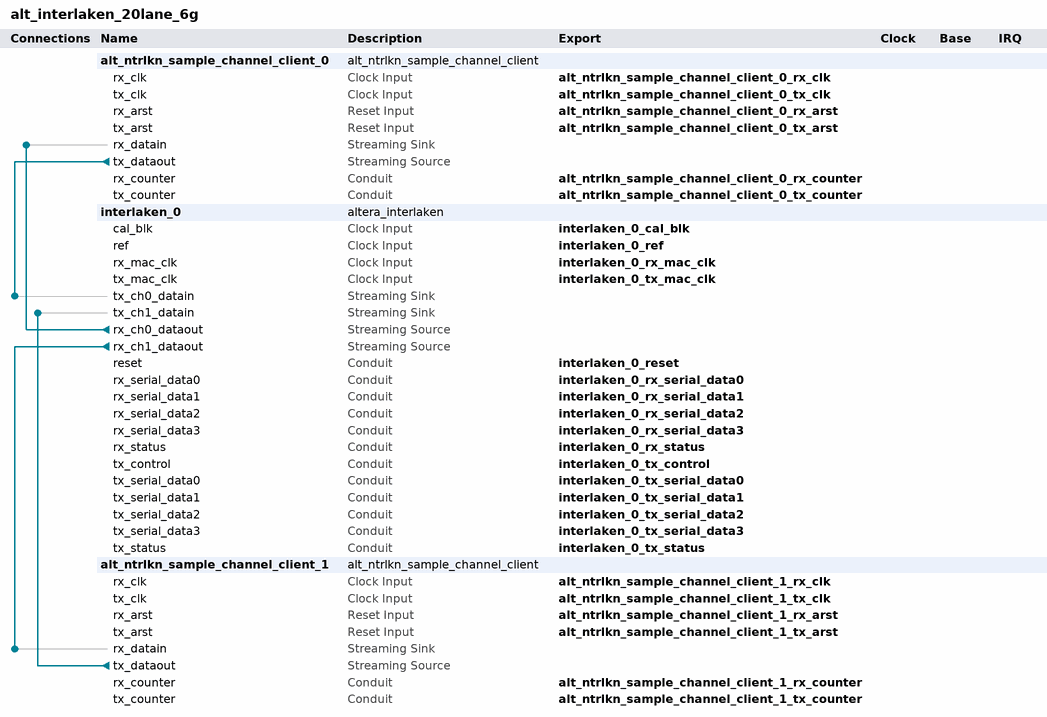
[diagram p0: system contents]
# Platform Designer (Qsys) system alt_interlaken_20lane_6g
# Parameters at their usual value, and those the tool derives, are not listed.
package require -exact qsys 11.1
create_system alt_interlaken_20lane_6g
set_project_property DEVICE_FAMILY STRATIXIV

add_instance alt_ntrlkn_sample_channel_client_0 alt_ntrlkn_sample_channel_client 11.1
set_instance_parameter_value alt_ntrlkn_sample_channel_client_0 DATAPATH_WIDTH 512

add_instance interlaken_0 altera_interlaken 11.1
set_instance_parameter_value interlaken_0 OPERATIONAL_MODE 0
set_instance_parameter_value interlaken_0 LANES 20
set_instance_parameter_value interlaken_0 LANE_RATE 6250.0
set_instance_parameter_value interlaken_0 META_FRAME_LEN 64
set_instance_parameter_value interlaken_0 GUI_BURST_MAX 128
set_instance_parameter_value interlaken_0 NUM_CHANNELS 2
set_instance_parameter_value interlaken_0 GUI_ENABLE_HSIO 0
set_instance_parameter_value interlaken_0 GUI_ENABLE_OOB 0
set_instance_parameter_value interlaken_0 SIM_FAST_RESET 0

add_instance alt_ntrlkn_sample_channel_client_1 alt_ntrlkn_sample_channel_client 11.1
set_instance_parameter_value alt_ntrlkn_sample_channel_client_1 DATAPATH_WIDTH 512

# connections
add_connection alt_ntrlkn_sample_channel_client_0.tx_dataout interlaken_0.tx_ch0_datain avalon_streaming
add_connection alt_ntrlkn_sample_channel_client_1.tx_dataout interlaken_0.tx_ch1_datain avalon_streaming
add_connection interlaken_0.rx_ch0_dataout alt_ntrlkn_sample_channel_client_0.rx_datain avalon_streaming
add_connection interlaken_0.rx_ch1_dataout alt_ntrlkn_sample_channel_client_1.rx_datain avalon_streaming

# exported interfaces
add_interface alt_ntrlkn_sample_channel_client_0_tx_clk clock sink
set_interface_property alt_ntrlkn_sample_channel_client_0_tx_clk EXPORT_OF alt_ntrlkn_sample_channel_client_0.tx_clk
add_interface alt_ntrlkn_sample_channel_client_0_tx_arst reset sink
set_interface_property alt_ntrlkn_sample_channel_client_0_tx_arst EXPORT_OF alt_ntrlkn_sample_channel_client_0.tx_arst
add_interface alt_ntrlkn_sample_channel_client_0_rx_clk clock sink
set_interface_property alt_ntrlkn_sample_channel_client_0_rx_clk EXPORT_OF alt_ntrlkn_sample_channel_client_0.rx_clk
add_interface alt_ntrlkn_sample_channel_client_0_rx_arst reset sink
set_interface_property alt_ntrlkn_sample_channel_client_0_rx_arst EXPORT_OF alt_ntrlkn_sample_channel_client_0.rx_arst
add_interface alt_ntrlkn_sample_channel_client_0_tx_counter conduit end
set_interface_property alt_ntrlkn_sample_channel_client_0_tx_counter EXPORT_OF alt_ntrlkn_sample_channel_client_0.tx_counter
add_interface alt_ntrlkn_sample_channel_client_0_rx_counter conduit end
set_interface_property alt_ntrlkn_sample_channel_client_0_rx_counter EXPORT_OF alt_ntrlkn_sample_channel_client_0.rx_counter
add_interface interlaken_0_tx_mac_clk clock sink
set_interface_property interlaken_0_tx_mac_clk EXPORT_OF interlaken_0.tx_mac_clk
add_interface interlaken_0_rx_mac_clk clock sink
set_interface_property interlaken_0_rx_mac_clk EXPORT_OF interlaken_0.rx_mac_clk
add_interface interlaken_0_tx_serial_data0 conduit end
set_interface_property interlaken_0_tx_serial_data0 EXPORT_OF interlaken_0.tx_serial_data0
add_interface interlaken_0_rx_serial_data0 conduit end
set_interface_property interlaken_0_rx_serial_data0 EXPORT_OF interlaken_0.rx_serial_data0
add_interface interlaken_0_tx_serial_data1 conduit end
set_interface_property interlaken_0_tx_serial_data1 EXPORT_OF interlaken_0.tx_serial_data1
add_interface interlaken_0_rx_serial_data1 conduit end
set_interface_property interlaken_0_rx_serial_data1 EXPORT_OF interlaken_0.rx_serial_data1
add_interface interlaken_0_tx_serial_data2 conduit end
set_interface_property interlaken_0_tx_serial_data2 EXPORT_OF interlaken_0.tx_serial_data2
add_interface interlaken_0_rx_serial_data2 conduit end
set_interface_property interlaken_0_rx_serial_data2 EXPORT_OF interlaken_0.rx_serial_data2
add_interface interlaken_0_tx_serial_data3 conduit end
set_interface_property interlaken_0_tx_serial_data3 EXPORT_OF interlaken_0.tx_serial_data3
add_interface interlaken_0_rx_serial_data3 conduit end
set_interface_property interlaken_0_rx_serial_data3 EXPORT_OF interlaken_0.rx_serial_data3
add_interface alt_ntrlkn_sample_channel_client_1_tx_clk clock sink
set_interface_property alt_ntrlkn_sample_channel_client_1_tx_clk EXPORT_OF alt_ntrlkn_sample_channel_client_1.tx_clk
add_interface alt_ntrlkn_sample_channel_client_1_tx_arst reset sink
set_interface_property alt_ntrlkn_sample_channel_client_1_tx_arst EXPORT_OF alt_ntrlkn_sample_channel_client_1.tx_arst
add_interface alt_ntrlkn_sample_channel_client_1_rx_clk clock sink
set_interface_property alt_ntrlkn_sample_channel_client_1_rx_clk EXPORT_OF alt_ntrlkn_sample_channel_client_1.rx_clk
add_interface alt_ntrlkn_sample_channel_client_1_rx_arst reset sink
set_interface_property alt_ntrlkn_sample_channel_client_1_rx_arst EXPORT_OF alt_ntrlkn_sample_channel_client_1.rx_arst
add_interface alt_ntrlkn_sample_channel_client_1_tx_counter conduit end
set_interface_property alt_ntrlkn_sample_channel_client_1_tx_counter EXPORT_OF alt_ntrlkn_sample_channel_client_1.tx_counter
add_interface alt_ntrlkn_sample_channel_client_1_rx_counter conduit end
set_interface_property alt_ntrlkn_sample_channel_client_1_rx_counter EXPORT_OF alt_ntrlkn_sample_channel_client_1.rx_counter
add_interface interlaken_0_rx_status conduit end
set_interface_property interlaken_0_rx_status EXPORT_OF interlaken_0.rx_status
add_interface interlaken_0_tx_status conduit end
set_interface_property interlaken_0_tx_status EXPORT_OF interlaken_0.tx_status
add_interface interlaken_0_tx_control conduit end
set_interface_property interlaken_0_tx_control EXPORT_OF interlaken_0.tx_control
add_interface interlaken_0_ref clock sink
set_interface_property interlaken_0_ref EXPORT_OF interlaken_0.ref
add_interface interlaken_0_cal_blk clock sink
set_interface_property interlaken_0_cal_blk EXPORT_OF interlaken_0.cal_blk
add_interface interlaken_0_reset conduit end
set_interface_property interlaken_0_reset EXPORT_OF interlaken_0.reset

save_system alt_interlaken_20lane_6g.qsys
